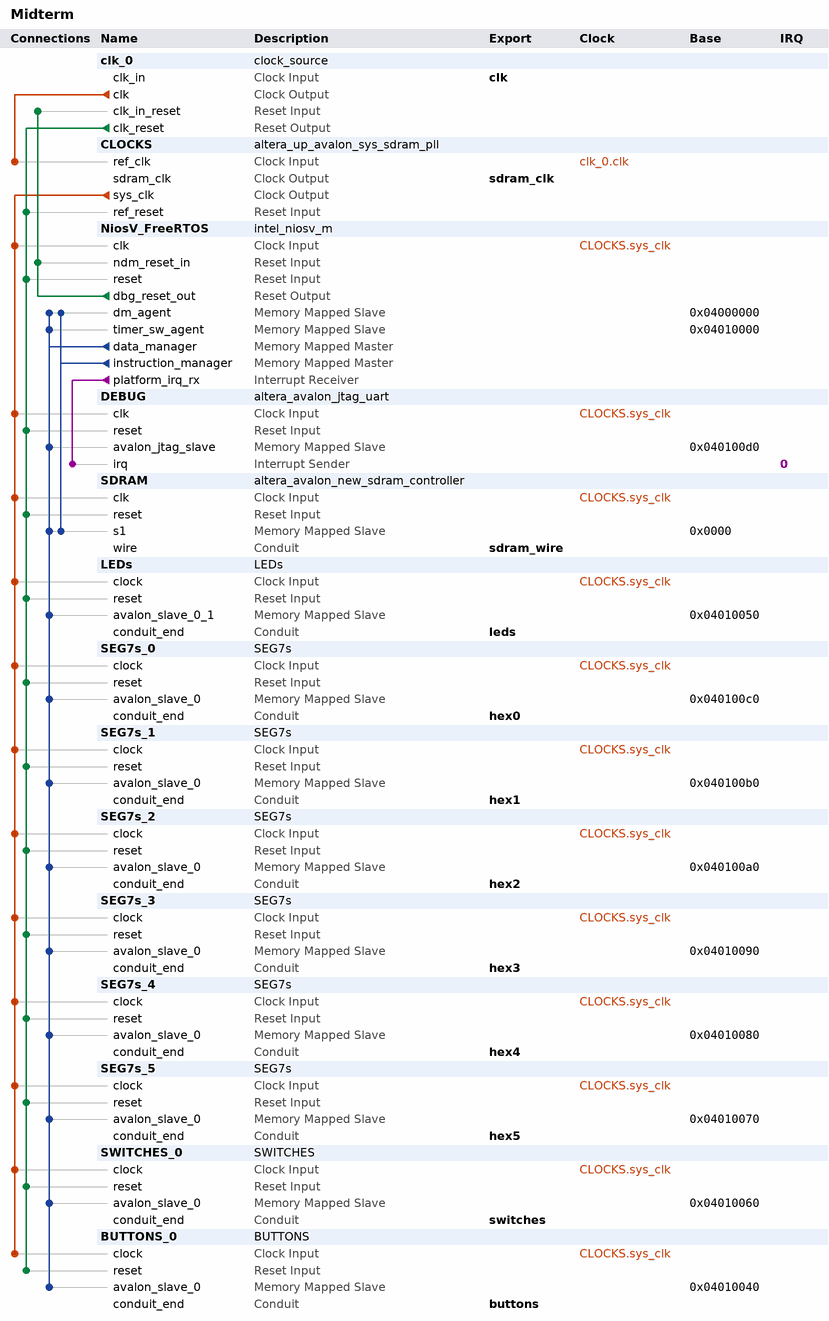
[diagram p0: system contents]
# Platform Designer (Qsys) system Midterm, Cyclone V 5CSXFC6D6F31C6
# Parameters at their usual value, and those the tool derives, are not listed.
package require -exact qsys 23.1
create_system Midterm
set_project_property DEVICE_FAMILY {Cyclone V}
set_project_property DEVICE 5CSXFC6D6F31C6

add_instance clk_0 clock_source 23.1
set_instance_parameter_value clk_0 clockFrequency 50000000

add_instance CLOCKS altera_up_avalon_sys_sdram_pll 18.0
set_instance_parameter_value CLOCKS CV_boards DE10-Standard
set_instance_parameter_value CLOCKS gui_outclk 50.0
set_instance_parameter_value CLOCKS gui_refclk 50.0

add_instance NiosV_FreeRTOS intel_niosv_m 2.0.0
set_instance_parameter_value NiosV_FreeRTOS enableDebugReset true
set_instance_parameter_value NiosV_FreeRTOS enableECCLite false
set_instance_parameter_value NiosV_FreeRTOS pipelineArch true
set_instance_parameter_value NiosV_FreeRTOS resetSlave SDRAM.s1

add_instance DEBUG altera_avalon_jtag_uart 23.1
set_instance_parameter_value DEBUG simInteractiveOptions NO_INTERACTIVE_WINDOWS

add_instance SDRAM altera_avalon_new_sdram_controller 20.1
set_instance_parameter_value SDRAM TAC 5.4
set_instance_parameter_value SDRAM TMRD 2
set_instance_parameter_value SDRAM TRCD 15.0
set_instance_parameter_value SDRAM TRP 15.0
set_instance_parameter_value SDRAM casLatency 3
set_instance_parameter_value SDRAM columnWidth 10
set_instance_parameter_value SDRAM dataWidth 16
set_instance_parameter_value SDRAM generateSimulationModel false
set_instance_parameter_value SDRAM model single_Micron_MT48LC4M32B2_7_chip
set_instance_parameter_value SDRAM numberOfBanks 4
set_instance_parameter_value SDRAM numberOfChipSelects 1
set_instance_parameter_value SDRAM powerUpDelay 100.0
set_instance_parameter_value SDRAM refreshPeriod 7.8125
set_instance_parameter_value SDRAM rowWidth 13

add_instance LEDs LEDs 1.0

add_instance SEG7s_0 SEG7s 1.0

add_instance SEG7s_1 SEG7s 1.0

add_instance SEG7s_2 SEG7s 1.0

add_instance SEG7s_3 SEG7s 1.0

add_instance SEG7s_4 SEG7s 1.0

add_instance SEG7s_5 SEG7s 1.0

add_instance SWITCHES_0 SWITCHES 1.0

add_instance BUTTONS_0 BUTTONS 1.0

# connections
add_connection clk_0.clk CLOCKS.ref_clk clock
add_connection CLOCKS.sys_clk BUTTONS_0.clock clock
add_connection CLOCKS.sys_clk DEBUG.clk clock
add_connection CLOCKS.sys_clk LEDs.clock clock
add_connection CLOCKS.sys_clk NiosV_FreeRTOS.clk clock
add_connection CLOCKS.sys_clk SDRAM.clk clock
add_connection CLOCKS.sys_clk SEG7s_0.clock clock
add_connection CLOCKS.sys_clk SEG7s_1.clock clock
add_connection CLOCKS.sys_clk SEG7s_2.clock clock
add_connection CLOCKS.sys_clk SEG7s_3.clock clock
add_connection CLOCKS.sys_clk SEG7s_4.clock clock
add_connection CLOCKS.sys_clk SEG7s_5.clock clock
add_connection CLOCKS.sys_clk SWITCHES_0.clock clock
add_connection clk_0.clk_reset BUTTONS_0.reset reset
add_connection clk_0.clk_reset CLOCKS.ref_reset reset
add_connection clk_0.clk_reset DEBUG.reset reset
add_connection clk_0.clk_reset LEDs.reset reset
add_connection clk_0.clk_reset NiosV_FreeRTOS.reset reset
add_connection clk_0.clk_reset SDRAM.reset reset
add_connection clk_0.clk_reset SEG7s_0.reset reset
add_connection clk_0.clk_reset SEG7s_1.reset reset
add_connection clk_0.clk_reset SEG7s_2.reset reset
add_connection clk_0.clk_reset SEG7s_3.reset reset
add_connection clk_0.clk_reset SEG7s_4.reset reset
add_connection clk_0.clk_reset SEG7s_5.reset reset
add_connection clk_0.clk_reset SWITCHES_0.reset reset
add_connection NiosV_FreeRTOS.dbg_reset_out clk_0.clk_in_reset reset
add_connection NiosV_FreeRTOS.dbg_reset_out NiosV_FreeRTOS.ndm_reset_in reset
add_connection NiosV_FreeRTOS.data_manager BUTTONS_0.avalon_slave_0 avalon
set_connection_parameter_value NiosV_FreeRTOS.data_manager/BUTTONS_0.avalon_slave_0 baseAddress 0x04010040
add_connection NiosV_FreeRTOS.data_manager DEBUG.avalon_jtag_slave avalon
set_connection_parameter_value NiosV_FreeRTOS.data_manager/DEBUG.avalon_jtag_slave baseAddress 0x040100d0
add_connection NiosV_FreeRTOS.data_manager LEDs.avalon_slave_0_1 avalon
set_connection_parameter_value NiosV_FreeRTOS.data_manager/LEDs.avalon_slave_0_1 baseAddress 0x04010050
add_connection NiosV_FreeRTOS.data_manager NiosV_FreeRTOS.dm_agent avalon
set_connection_parameter_value NiosV_FreeRTOS.data_manager/NiosV_FreeRTOS.dm_agent baseAddress 0x04000000
add_connection NiosV_FreeRTOS.data_manager NiosV_FreeRTOS.timer_sw_agent avalon
set_connection_parameter_value NiosV_FreeRTOS.data_manager/NiosV_FreeRTOS.timer_sw_agent baseAddress 0x04010000
add_connection NiosV_FreeRTOS.data_manager SDRAM.s1 avalon
set_connection_parameter_value NiosV_FreeRTOS.data_manager/SDRAM.s1 baseAddress 0x0000
add_connection NiosV_FreeRTOS.data_manager SEG7s_0.avalon_slave_0 avalon
set_connection_parameter_value NiosV_FreeRTOS.data_manager/SEG7s_0.avalon_slave_0 baseAddress 0x040100c0
add_connection NiosV_FreeRTOS.data_manager SEG7s_1.avalon_slave_0 avalon
set_connection_parameter_value NiosV_FreeRTOS.data_manager/SEG7s_1.avalon_slave_0 baseAddress 0x040100b0
add_connection NiosV_FreeRTOS.data_manager SEG7s_2.avalon_slave_0 avalon
set_connection_parameter_value NiosV_FreeRTOS.data_manager/SEG7s_2.avalon_slave_0 baseAddress 0x040100a0
add_connection NiosV_FreeRTOS.data_manager SEG7s_3.avalon_slave_0 avalon
set_connection_parameter_value NiosV_FreeRTOS.data_manager/SEG7s_3.avalon_slave_0 baseAddress 0x04010090
add_connection NiosV_FreeRTOS.data_manager SEG7s_4.avalon_slave_0 avalon
set_connection_parameter_value NiosV_FreeRTOS.data_manager/SEG7s_4.avalon_slave_0 baseAddress 0x04010080
add_connection NiosV_FreeRTOS.data_manager SEG7s_5.avalon_slave_0 avalon
set_connection_parameter_value NiosV_FreeRTOS.data_manager/SEG7s_5.avalon_slave_0 baseAddress 0x04010070
add_connection NiosV_FreeRTOS.data_manager SWITCHES_0.avalon_slave_0 avalon
set_connection_parameter_value NiosV_FreeRTOS.data_manager/SWITCHES_0.avalon_slave_0 baseAddress 0x04010060
add_connection NiosV_FreeRTOS.instruction_manager NiosV_FreeRTOS.dm_agent avalon
set_connection_parameter_value NiosV_FreeRTOS.instruction_manager/NiosV_FreeRTOS.dm_agent baseAddress 0x04000000
add_connection NiosV_FreeRTOS.instruction_manager SDRAM.s1 avalon
set_connection_parameter_value NiosV_FreeRTOS.instruction_manager/SDRAM.s1 baseAddress 0x0000
add_connection NiosV_FreeRTOS.platform_irq_rx DEBUG.irq interrupt
set_connection_parameter_value NiosV_FreeRTOS.platform_irq_rx/DEBUG.irq irqNumber 0

# exported interfaces
add_interface buttons conduit end
set_interface_property buttons EXPORT_OF BUTTONS_0.conduit_end
add_interface clk clock sink
set_interface_property clk EXPORT_OF clk_0.clk_in
add_interface hex0 conduit end
set_interface_property hex0 EXPORT_OF SEG7s_0.conduit_end
add_interface hex1 conduit end
set_interface_property hex1 EXPORT_OF SEG7s_1.conduit_end
add_interface hex2 conduit end
set_interface_property hex2 EXPORT_OF SEG7s_2.conduit_end
add_interface hex3 conduit end
set_interface_property hex3 EXPORT_OF SEG7s_3.conduit_end
add_interface hex4 conduit end
set_interface_property hex4 EXPORT_OF SEG7s_4.conduit_end
add_interface hex5 conduit end
set_interface_property hex5 EXPORT_OF SEG7s_5.conduit_end
add_interface leds conduit end
set_interface_property leds EXPORT_OF LEDs.conduit_end
add_interface sdram_clk clock source
set_interface_property sdram_clk EXPORT_OF CLOCKS.sdram_clk
add_interface sdram_wire conduit end
set_interface_property sdram_wire EXPORT_OF SDRAM.wire
add_interface switches conduit end
set_interface_property switches EXPORT_OF SWITCHES_0.conduit_end

set_interconnect_requirement {$system} qsys_mm.clockCrossingAdapter HANDSHAKE
set_interconnect_requirement {$system} qsys_mm.enableEccProtection FALSE
set_interconnect_requirement {$system} qsys_mm.insertDefaultSlave FALSE
set_interconnect_requirement {$system} qsys_mm.maxAdditionalLatency 1

save_system Midterm.qsys
